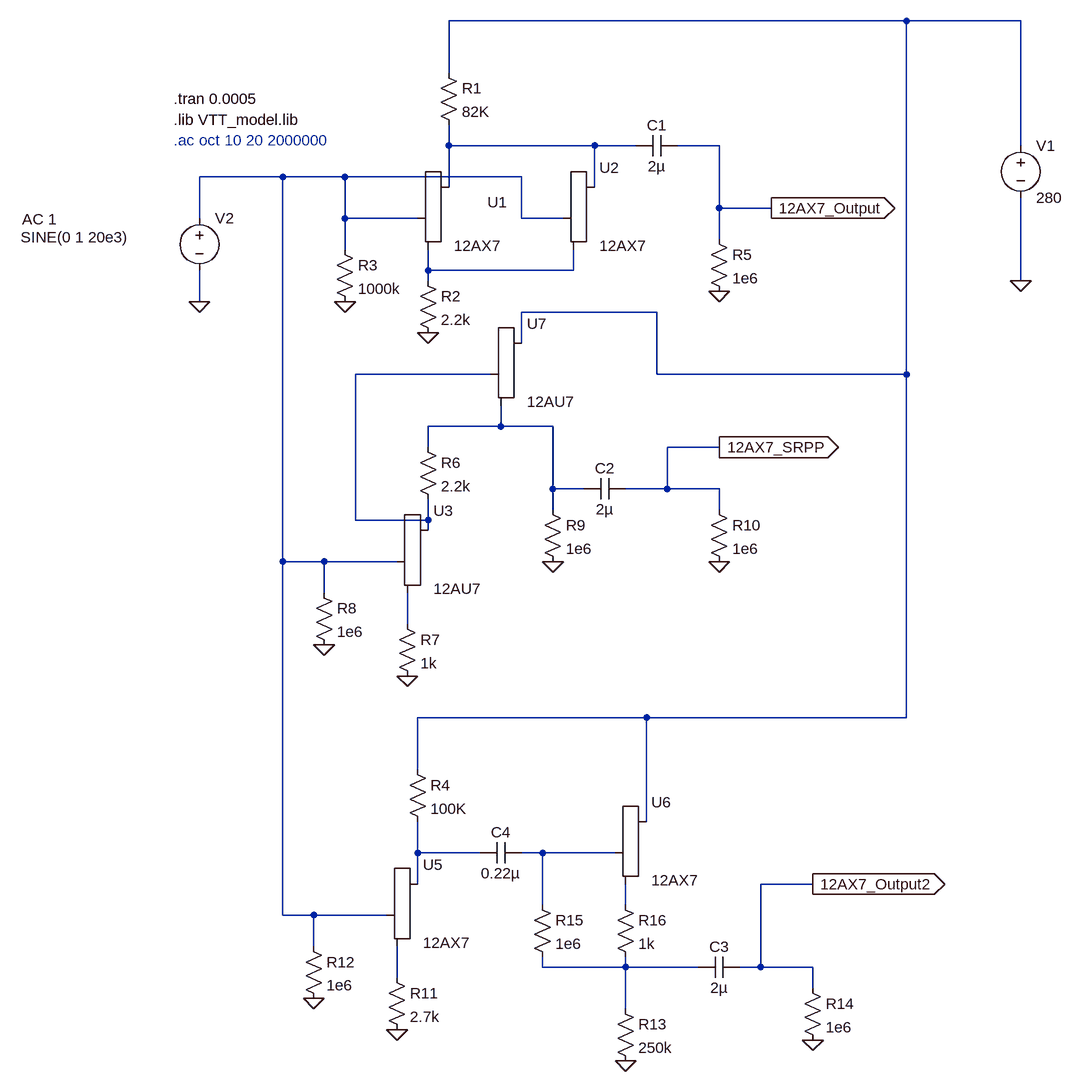
[diagram p0: schematic PreMod_12AX7.asc]
PreMod_12AX7.asc, the LTspice schematic file:
Version 4.1
SHEET 1 1144 1444
WIRE 896 -176 192 -176
WIRE 1072 -176 896 -176
WIRE 192 -96 192 -176
WIRE 192 16 192 -16
WIRE 416 16 192 16
WIRE 480 16 416 16
WIRE 608 16 544 16
WIRE 1072 16 1072 -176
WIRE -64 64 -192 64
WIRE 32 64 -64 64
WIRE 304 64 32 64
WIRE 192 80 192 16
WIRE 416 80 416 16
WIRE 608 112 608 16
WIRE 688 112 608 112
WIRE -192 128 -192 64
WIRE 32 128 32 64
WIRE 144 128 32 128
WIRE 304 128 304 64
WIRE 368 128 304 128
WIRE 608 160 608 112
WIRE 32 176 32 128
WIRE 160 208 160 176
WIRE 384 208 384 176
WIRE 384 208 160 208
WIRE 160 224 160 208
WIRE 1072 224 1072 96
WIRE -192 256 -192 208
WIRE 512 272 304 272
WIRE 304 320 304 272
WIRE 256 368 48 368
WIRE 512 368 512 272
WIRE 896 368 896 -176
WIRE 896 368 512 368
WIRE 272 448 272 416
WIRE 272 448 160 448
WIRE 352 448 272 448
WIRE 160 480 160 448
WIRE 608 480 528 480
WIRE 352 544 352 448
WIRE 400 544 352 544
WIRE 528 544 528 480
WIRE 528 544 464 544
WIRE 608 544 528 544
WIRE 352 576 352 544
WIRE 608 576 608 544
WIRE 48 592 48 368
WIRE 160 592 160 560
WIRE 160 592 48 592
WIRE 160 608 160 592
WIRE -64 656 -64 64
WIRE 0 656 -64 656
WIRE 112 656 0 656
WIRE 0 704 0 656
WIRE 128 752 128 704
WIRE 496 896 144 896
WIRE 896 896 896 368
WIRE 896 896 496 896
WIRE 144 976 144 896
WIRE 496 1056 496 896
WIRE 144 1104 144 1056
WIRE 240 1104 144 1104
WIRE 336 1104 304 1104
WIRE 448 1104 336 1104
WIRE 144 1152 144 1104
WIRE 752 1152 672 1152
WIRE 336 1184 336 1104
WIRE 464 1184 464 1152
WIRE -64 1200 -64 656
WIRE -16 1200 -64 1200
WIRE 96 1200 -16 1200
WIRE -16 1248 -16 1200
WIRE 336 1280 336 1264
WIRE 464 1280 464 1264
WIRE 464 1280 336 1280
WIRE 576 1280 464 1280
WIRE 672 1280 672 1152
WIRE 672 1280 640 1280
WIRE 752 1280 672 1280
WIRE 112 1296 112 1248
WIRE 752 1312 752 1280
WIRE 464 1344 464 1280
FLAG 160 304 0
FLAG 32 256 0
FLAG 608 240 0
FLAG 1072 224 0
FLAG -192 256 0
FLAG 128 832 0
FLAG 0 784 0
FLAG 608 656 0
FLAG 688 112 12AX7_Output
IOPIN 688 112 Out
FLAG 608 480 12AX7_SRPP
IOPIN 608 480 Out
FLAG 112 1376 0
FLAG -16 1328 0
FLAG 464 1424 0
FLAG 752 1392 0
FLAG 752 1152 12AX7_Output2
IOPIN 752 1152 Out
FLAG 352 656 0
SYMBOL Misc\\triode 192 128 R0
WINDOW 0 59 -25 Left 2
SYMATTR InstName U1
SYMATTR Value 12AX7
SYMBOL voltage 1072 0 R0
WINDOW 123 0 0 Left 0
WINDOW 39 0 0 Left 0
SYMATTR InstName V1
SYMATTR Value 280
SYMBOL Misc\\triode 416 128 R0
SYMATTR InstName U2
SYMATTR Value 12AX7
SYMBOL res 176 -112 R0
SYMATTR InstName R1
SYMATTR Value 82K
SYMBOL res 144 208 R0
SYMATTR InstName R2
SYMATTR Value 2.2k
SYMBOL res 16 160 R0
SYMATTR InstName R3
SYMATTR Value 1000k
SYMBOL res 592 144 R0
SYMATTR InstName R5
SYMATTR Value 1e6
SYMBOL cap 544 0 R90
WINDOW 0 0 32 VBottom 2
WINDOW 3 32 32 VTop 2
SYMATTR InstName C1
SYMATTR Value 2µ
SYMBOL voltage -192 112 R0
WINDOW 123 -273 17 Left 2
WINDOW 39 0 0 Left 0
WINDOW 3 -275 45 Left 2
SYMATTR Value2 AC 1
SYMATTR Value SINE(0 1 20e3)
SYMATTR InstName V2
SYMBOL Misc\\triode 160 656 R0
SYMATTR InstName U3
SYMATTR Value 12AU7
SYMBOL res 144 464 R0
SYMATTR InstName R6
SYMATTR Value 2.2k
SYMBOL res 112 736 R0
SYMATTR InstName R7
SYMATTR Value 1k
SYMBOL res -16 688 R0
SYMATTR InstName R8
SYMATTR Value 1e6
SYMBOL res 592 560 R0
SYMATTR InstName R10
SYMATTR Value 1e6
SYMBOL cap 464 528 R90
WINDOW 0 0 32 VBottom 2
WINDOW 3 32 32 VTop 2
SYMATTR InstName C2
SYMATTR Value 2µ
SYMBOL Misc\\triode 144 1200 R0
SYMATTR InstName U5
SYMATTR Value 12AX7
SYMBOL Misc\\triode 496 1104 R0
SYMATTR InstName U6
SYMATTR Value 12AX7
SYMBOL res 128 960 R0
SYMATTR InstName R4
SYMATTR Value 100K
SYMBOL res 96 1280 R0
SYMATTR InstName R11
SYMATTR Value 2.7k
SYMBOL res -32 1232 R0
SYMATTR InstName R12
SYMATTR Value 1e6
SYMBOL res 448 1328 R0
SYMATTR InstName R13
SYMATTR Value 250k
SYMBOL res 736 1296 R0
SYMATTR InstName R14
SYMATTR Value 1e6
SYMBOL cap 640 1264 R90
WINDOW 0 0 32 VBottom 2
WINDOW 3 32 32 VTop 2
SYMATTR InstName C3
SYMATTR Value 2µ
SYMBOL cap 304 1088 R90
WINDOW 0 0 32 VBottom 2
WINDOW 3 32 32 VTop 2
SYMATTR InstName C4
SYMATTR Value 0.22µ
SYMBOL res 320 1168 R0
SYMATTR InstName R15
SYMATTR Value 1e6
SYMBOL res 448 1168 R0
SYMATTR InstName R16
SYMATTR Value 1k
SYMBOL Misc\\triode 304 368 R0
SYMATTR InstName U7
SYMATTR Value 12AU7
SYMBOL res 336 560 R0
SYMATTR InstName R9
SYMATTR Value 1e6
TEXT -232 -24 Left 2 !.lib VTT_model.lib
TEXT -232 8 Left 2 ;.ac oct 10 20 2000000
TEXT -232 -56 Left 2 !.tran 0.0005

The netlist it stands for:
* PreMod_12AX7.asc
X§U1 N002 N003 N004 12AX7
V1 N001 0 280
X§U2 N002 N003 N004 12AX7
R1 N001 N002 82K
R2 N004 0 2.2k
R3 N003 0 1000k
R5 12AX7_Output 0 1e6
C1 12AX7_Output N002 2µ
V2 N003 0 SINE(0 1 20e3) AC 1
X§U3 N005 N003 N007 12AU7
R6 N006 N005 2.2k
R7 N007 0 1k
R8 N003 0 1e6
R10 12AX7_SRPP 0 1e6
C2 12AX7_SRPP N006 2µ
X§U5 N008 N003 N012 12AX7
X§U6 N001 N009 N010 12AX7
R4 N001 N008 100K
R11 N012 0 2.7k
R12 N003 0 1e6
R13 N011 0 250k
R14 12AX7_Output2 0 1e6
C3 12AX7_Output2 N011 2µ
C4 N009 N008 0.22µ
R15 N009 N011 1e6
R16 N010 N011 1k
X§U7 N001 N005 N006 12AU7
R9 N006 0 1e6
.lib VTT_model.lib
* .ac oct 10 20 2000000
.tran 0.0005
.backanno
.end